# Altium schematic sheet 温室大棚监控.SCHDOC
size A3
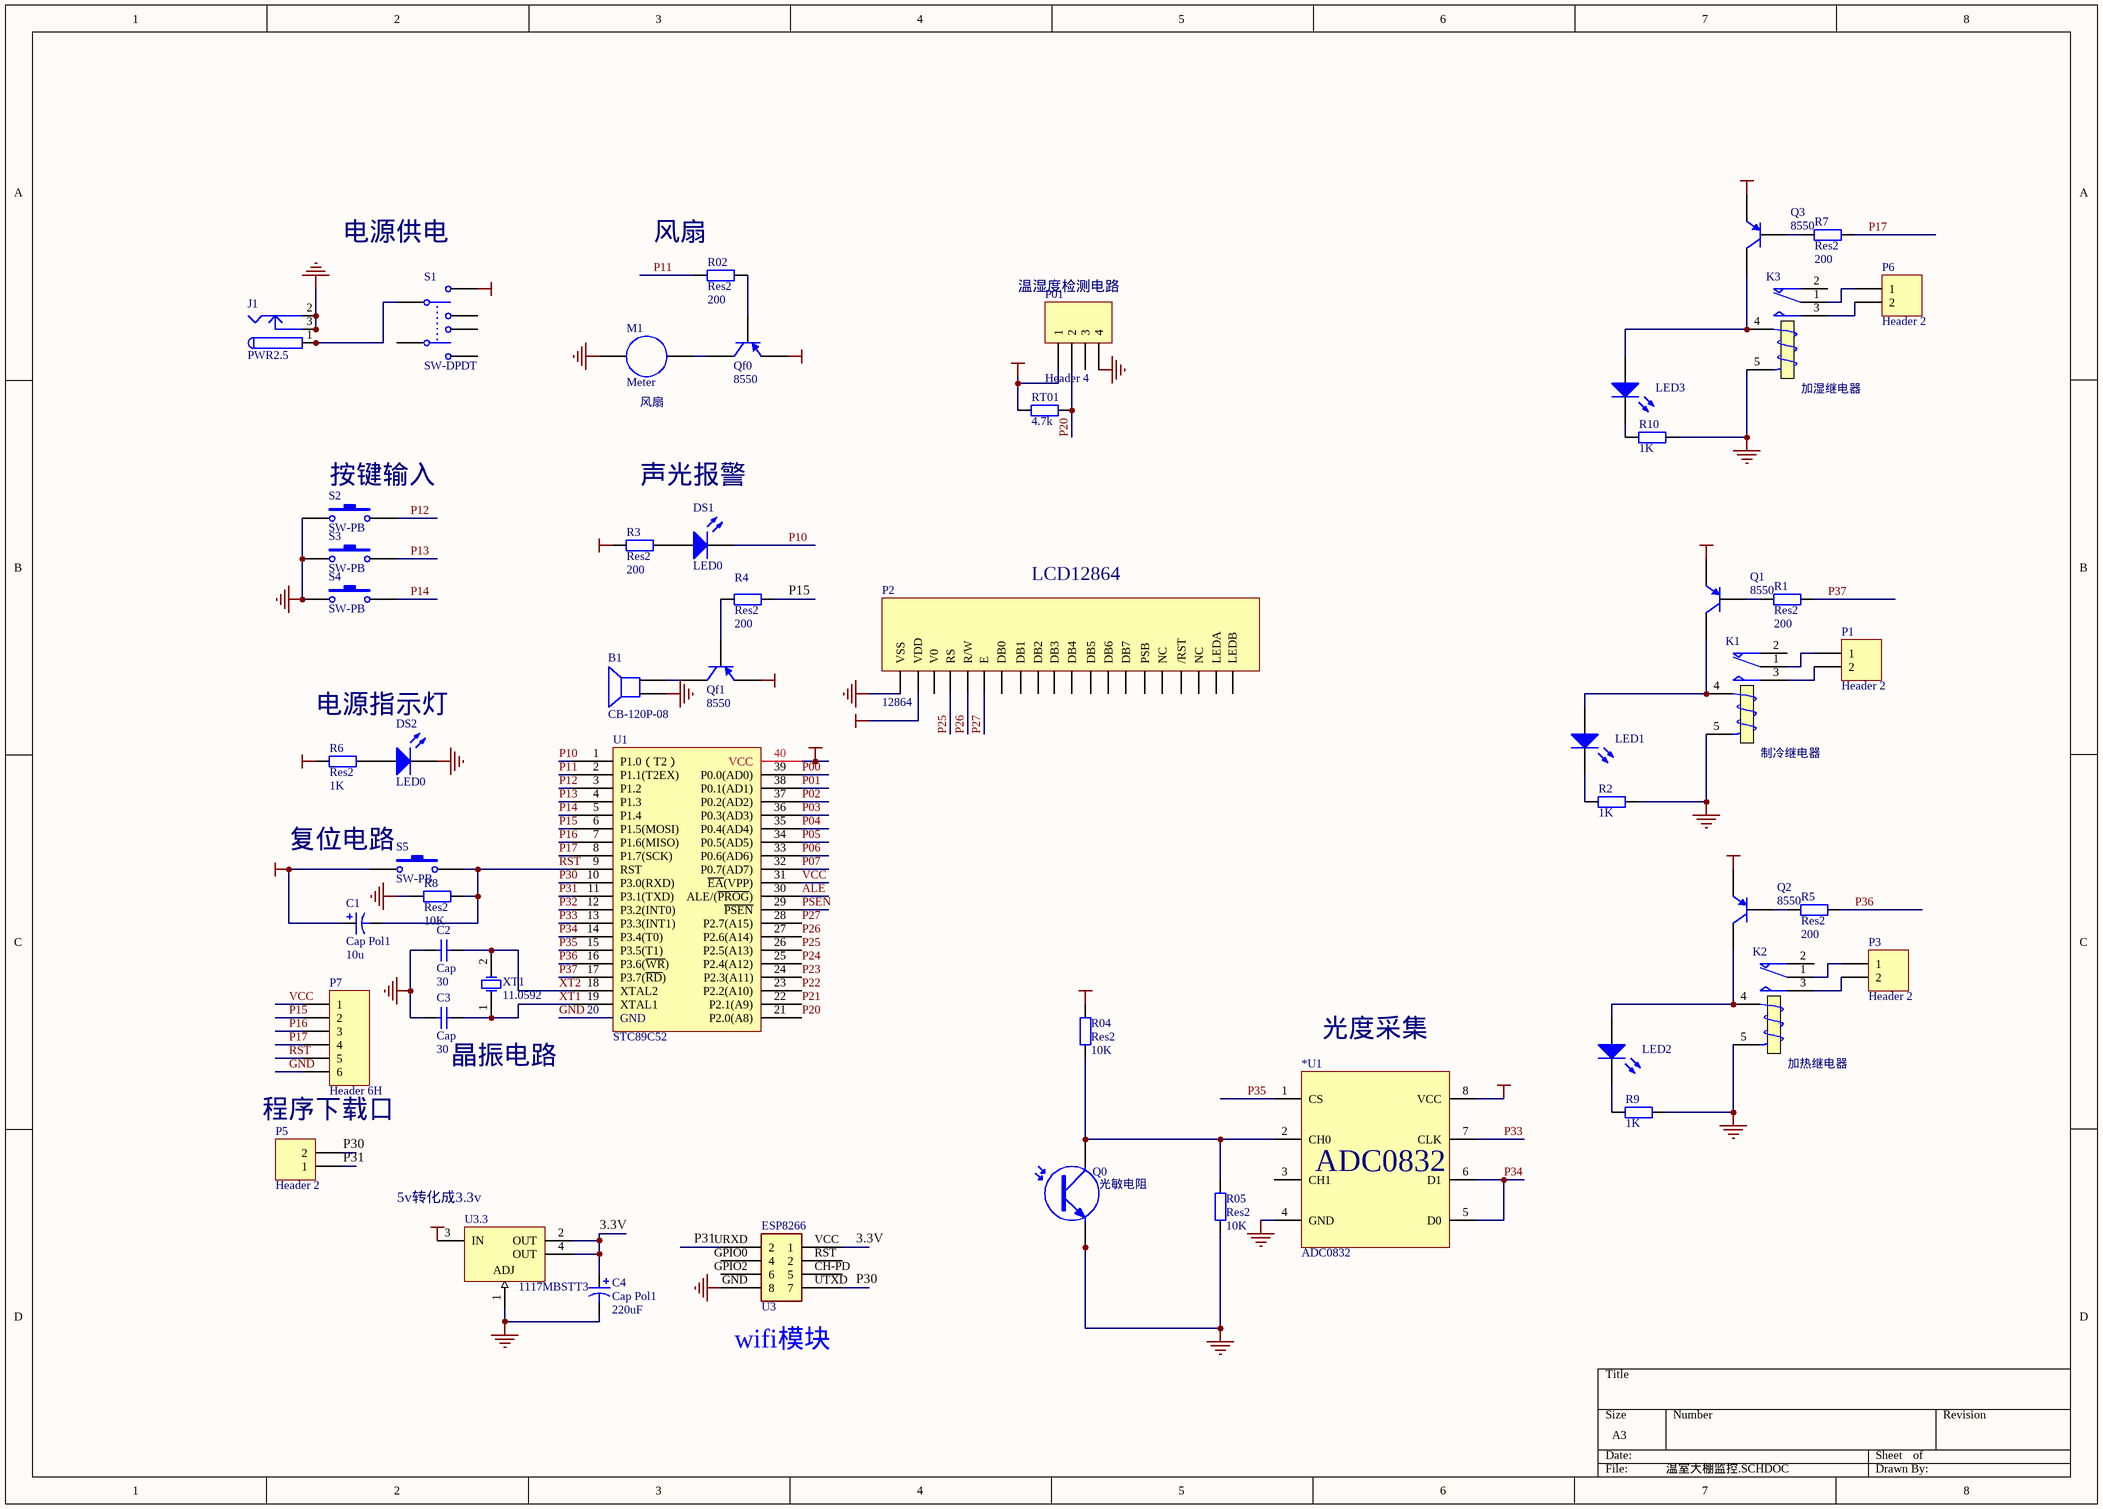
[diagram p0: 温室大棚监控.SCHDOC]

## Parts
*U1  ADC0832  [DIP8]
B1  CB-120P-08  [圆型蜂鸣器]
C1  Cap Pol1  value 10u  [电容]
C2  Cap  value 30  [RAD-0.1]
C3  Cap  value 30  [RAD-0.1]
C4  Cap Pol1  value 220uF  [电容]
DS1  LED0  [RAD-0.1]
DS2  LED0  [RAD-0.1]
ESP8266  U3  [HDR2X4]
J1  PWR2.5  [KLD-0202]
K1  制冷继电器  [继电器]
K2  加热继电器  [继电器]
K3  加湿继电器  [继电器]
LED1  LED0  [LED-1]  (value not drawn)
LED2  LED0  [LED-1]  (value not drawn)
LED3  LED0  [LED-1]  (value not drawn)
M1  Meter  [RAD-0.1]
P1  Header 2  [HDR1X2]
P01  Header 4  [HDR1X4]
P2  12864  [HDR1X6]
P3  Header 2  [HDR1X2]
P5  Header 2  [HDR1X2]
P6  Header 2  [HDR1X2]
P7  Header 6H  [HDR1X6]
Q0  光敏电阻  [SFM-T2(3)/X1.6V]
Q1  8550  [BCY-W3/E4]
Q2  8550  [BCY-W3/E4]
Q3  8550  [BCY-W3/E4]
Qf0  8550  [BCY-W3/E4]
Qf1  8550  [BCY-W3/E4]
R1  Res2  value 200  [AXIAL-0.4]
R2  value 1K  [AXIAL-0.4]  (hidden comment: Res2)
R02  Res2  value 200  [AXIAL-0.4]
R3  Res2  value 200  [AXIAL-0.4]
R4  Res2  value 200  [AXIAL-0.4]
R04  Res2  value 10K  [AXIAL-0.4]
R5  Res2  value 200  [AXIAL-0.4]
R05  Res2  value 10K  [AXIAL-0.4]
R6  Res2  value 1K  [AXIAL-0.4]
R7  Res2  value 200  [AXIAL-0.4]
R8  Res2  value 10K  [AXIAL-0.4]
R9  value 1K  [AXIAL-0.4]  (hidden comment: Res2)
R10  value 1K  [AXIAL-0.4]  (hidden comment: Res2)
RT01  value 4.7k  [AXIAL-0.3]  (hidden comment: Res2)
S1  SW-DPDT  [DPDT-6]
S2  SW-PB  [点动按键]
S3  SW-PB  [点动按键]
S4  SW-PB  [点动按键]
S5  SW-PB  [点动按键]
U1  STC89C52  [AT89S52]
U3.3  1117MBSTT3  [318E-04]
XT1  11.0592  [圆晶振]

## Nets
GND: *U1.4(GND) B1.1 C2.1 C3.1 C4.2 DS2.2(K) ESP8266.GND(8) J1.2 J1.2A J1.2B J1.3 J1.3A J1.3B K1.5(T2) K2.5(T2) K3.5(T2) M1.1 P01.4 P2.1(VSS) P7.6 Q0.3(E) R2.1 R05.1 R8.1 R9.1 R10.1 S2.1 S3.1 S4.1 U1.20(GND) U3.3.1(ADJ)
VCC: *U1.8(VCC) C1.1 P01.1 P2.2(VDD) P7.1 Q1.1(E) Q2.1(E) Q3.1(E) Qf0.1(E) Qf1.1(E) R3.1 R04.2 R6.1 RT01.2 S1.2 S5.1 U1.31(~{EA}(VPP)) U1.40(VCC) U3.3.3(IN)
3.3V: C4.1 ESP8266.VCC(1) U3.3.2(OUT) U3.3.4(OUT)
ALE: U1.30(ALE/(~{PROG}))
P00: U1.39(P0.0(AD0))
P01: U1.38(P0.1(AD1))
P02: U1.37(P0.2(AD2))
P03: U1.36(P0.3(AD3))
P04: U1.35(P0.4(AD4))
P05: U1.34(P0.5(AD5))
P06: U1.33(P0.6(AD6))
P07: U1.32(P0.7(AD7))
P10: DS1.2(K) U1.1(P1.0（T2）)
P11: R02.1 U1.2(P1.1(T2EX))
P12: S2.2 U1.3(P1.2)
P13: S3.2 U1.4(P1.3)
P14: S4.2 U1.5(P1.4)
P15: P7.2 R4.1 U1.6(P1.5(MOSI))
P16: P7.3 U1.7(P1.6(MISO))
P17: P7.4 R7.2 U1.8(P1.7(SCK))
P20: P01.2 RT01.1 U1.21(P2.0(A8))
P21: U1.22(P2.1(A9))
P22: U1.23(P2.2(A10))
P23: U1.24(P2.3(A11))
P24: U1.25(P2.4(A12))
P25: P2.4(RS) U1.26(P2.5(A13))
P26: P2.5(R/W) U1.27(P2.6(A14))
P27: P2.6(E) U1.28(P2.7(A15))
P30: ESP8266.UTXD(7) P5.2 U1.10(P3.0(RXD))
P31: ESP8266.URXD(2) P5.1 U1.11(P3.1(TXD))
P32: U1.12(P3.2(INT0))
P33: *U1.7(CLK) U1.13(P3.3(INT1))
P34: *U1.5(D0) *U1.6(D1) U1.14(P3.4(T0))
P35: *U1.1(CS) U1.15(P3.5(T1))
P36: R5.2 U1.16(P3.6(~{WR}))
P37: R1.2 U1.17(P3.7(~{RD}))
PSEN: U1.29(~{PSEN})
RST: C1.2 P7.5 R8.2 S5.2 U1.9(RST)
XT1: C3.2 U1.19(XTAL1) XT1.1(OSC1)
XT2: C2.2 U1.18(XTAL2) XT1.2(OSC2)
Net*U1_2: *U1.2(CH0) Q0.1(C) R04.1 R05.2
NetB1_2: B1.2 Qf1.3(C)
NetDS1_1: DS1.1(A) R3.2
NetDS2_1: DS2.1(A) R6.2
NetJ1_1: J1.1 J1.1A J1.1B S1.1
NetK1_1: K1.1(COM) P1.1
NetK1_3: K1.3(NO) P1.2
NetK1_4: K1.4(T1) LED1.1(A) Q1.3(C)
NetK2_1: K2.1(COM) P3.1
NetK2_3: K2.3(NO) P3.2
NetK2_4: K2.4(T1) LED2.1(A) Q2.3(C)
NetK3_1: K3.1(COM) P6.1
NetK3_3: K3.3(NO) P6.2
NetK3_4: K3.4(T1) LED3.1(A) Q3.3(C)
NetLED1_2: LED1.2(K) R2.2
NetLED2_2: LED2.2(K) R9.2
NetLED3_2: LED3.2(K) R10.2
NetM1_2: M1.2 Qf0.3(C)
NetQ1_2: Q1.2(B) R1.1
NetQ2_2: Q2.2(B) R5.1
NetQ3_2: Q3.2(B) R7.1
NetQf0_2: Qf0.2(B) R02.2
NetQf1_2: Qf1.2(B) R4.2

Not connected (* = marked no-connect by the designer): *U1 3(CH1); ESP8266 CH-PD(5) GPIO0(4) GPIO2(6) RST(2); K1 2(NC); K2 2(NC); K3 2(NC); P01 3; P2 3(V0) 7(DB0) 8(DB1) 9(DB2) 10(DB3) 11(DB4) 12(DB5) 13(DB6) 14(DB7) 15(PSB) 16(NC) 17(/RST) 18(NC) 19(LEDA) 20(LEDB); S1 3 4 5 6

## Notes on the sheet
- (near S1) 电源供电
- (near R02) 风扇
- (near P01) 温湿度检测电路
- (near M1) 风扇
- (near S2) 按键输入
- 声光报警
- LCD12864
- 电源指示灯
- 复位电路
- 光度采集
- 程序下载口
- (near C3) 晶振电路
- (near U3.3) 5v转化成3.3v
- (near ESP8266) wifi模块

## Library data of the parts
*U1 = Component_1
B1 = SPEAKER
C1 C4 = Cap Pol1: Polarized Capacitor (Radial); Published: 8-Jun-2000; LatestRevisionDate: 17-Jul-2002; LatestRevisionNote: Re-released for DXP Platform.; Publisher: Altium Limited
C2 C3 = Cap: Capacitor; Published: 8-Jun-2000; LatestRevisionDate: 17-Jul-2002; LatestRevisionNote: Re-released for DXP Platform.; Publisher: Altium Limited
DS1 DS2 LED1-LED3 = LED0: Typical INFRARED GaAs LED; Published: 8-Jun-2000; LatestRevisionDate: 17-Jul-2002; LatestRevisionNote: Re-released for DXP Platform.; Publisher: Altium Limited
ESP8266 = CZ8
J1 = PWR2.5: Low Voltage Power Supply Connector; Published: 17-Dec-2003; DatasheetDocument: 09-May-2002; Publisher: Altium Limited
K1-K3 = Relay: SPDT Relay; Published: 8-Jun-2000; LatestRevisionDate: 17-Jul-2002; LatestRevisionNote: Re-released for DXP Platform.; Publisher: Altium Limited
M1 = Meter: Indicating Instrument; Note: Place a "letter" into the symbol to show the function of the meter or instrument; Published: 24-Mar-1999; LatestRevisionDate: 17-Jul-2002; LatestRevisionNote: Re-released for DXP Platform.; Publisher: Altium Limited
P1 P3 P5 P6 = Header 2: Header, 2-Pin; LatestRevisionDate: 17-Jul-2002; LatestRevisionNote: Re-released for DXP Platform.; Publisher: Altium Limited
P01 = Header 4: Header, 4-Pin; LatestRevisionDate: 17-Jul-2002; LatestRevisionNote: Re-released for DXP Platform.; Publisher: Altium Limited
P7 = Header 6H: Header, 6-Pin, Right Angle; LatestRevisionDate: 17-Jul-2002; LatestRevisionNote: Re-released for DXP Platform.; Publisher: Altium Limited
Q0 = Photo NPN: NPN Phototransistor; Published: 24-Mar-1999; LatestRevisionDate: 17-Jul-2002; LatestRevisionNote: Re-released for DXP Platform.; Publisher: Altium Limited; Code_JEDEC: TO-220-AC
Q1-Q3 Qf0 Qf1 = 2N3906: PNP General Purpose Amplifier; Published: 8-Jun-2000; LatestRevisionDate: 15-Jan-2003; LatestRevisionNote: PCB Footprint 'BCY-W3/D4.7' replaced; DatasheetDocument: 1997; PackageReference: TO-92A; Publisher: Altium Limited; Code_JEDEC: TO-92A
R1 R2 R02-R4 R04 R5 R05-R10 RT01 = Res2: Resistor; Published: 8-Jun-2000; LatestRevisionDate: 17-Jul-2002; LatestRevisionNote: Re-released for DXP Platform.; Publisher: Altium Limited
S1 = SW-DPDT: Double-Pole, Double-Throw Switch; Published: 24-Mar-1999; LatestRevisionDate: 17-Jul-2002; LatestRevisionNote: Re-released for DXP Platform.; Publisher: Altium Limited
S2-S5 = SW-PB: Switch; Published: 24-Mar-1999; LatestRevisionDate: 17-Jul-2002; LatestRevisionNote: Re-released for DXP Platform.; Publisher: Altium Limited
U1 = AT89S52
U3.3 = LM317MBSTT3: Three-Terminal Adjustable Output Positive Voltage Regulator; Note: Pin 2 is electrically connected to Pin 4 (TAB); Published: 15-Apr-2002; DatasheetVersion: Nov-1999; PackageVersion: Nov-1999; PackageReference: 318E-04; Publisher: Altium Limited; PackageDescription: SOT-223/SC-73; 4 Leads; Body 6.7 x 7.3 mm, inc. leads (LxW max); ComponentLink1Description: Manufacturer Link; ComponentLink1URL: http://www.onsemi.com/site/products/taxonomy/0,4438,503,00.html; ComponentLink2Description: Datasheet; ComponentLink2URL: http://www.onsemi.com/pub/Collateral/LM317M-D.PDF
XT1 = XTAL2